# EasyEDA schematic JLCPCB_MEG_SCHEM.json

## Sheets
1 Sheet_1: TITLE: Sheet_1; REV: 1.0; Date: 2023-10-23; Sheet: 1/1; Drawn By: jbgs_ch_mex; Company: Your Company
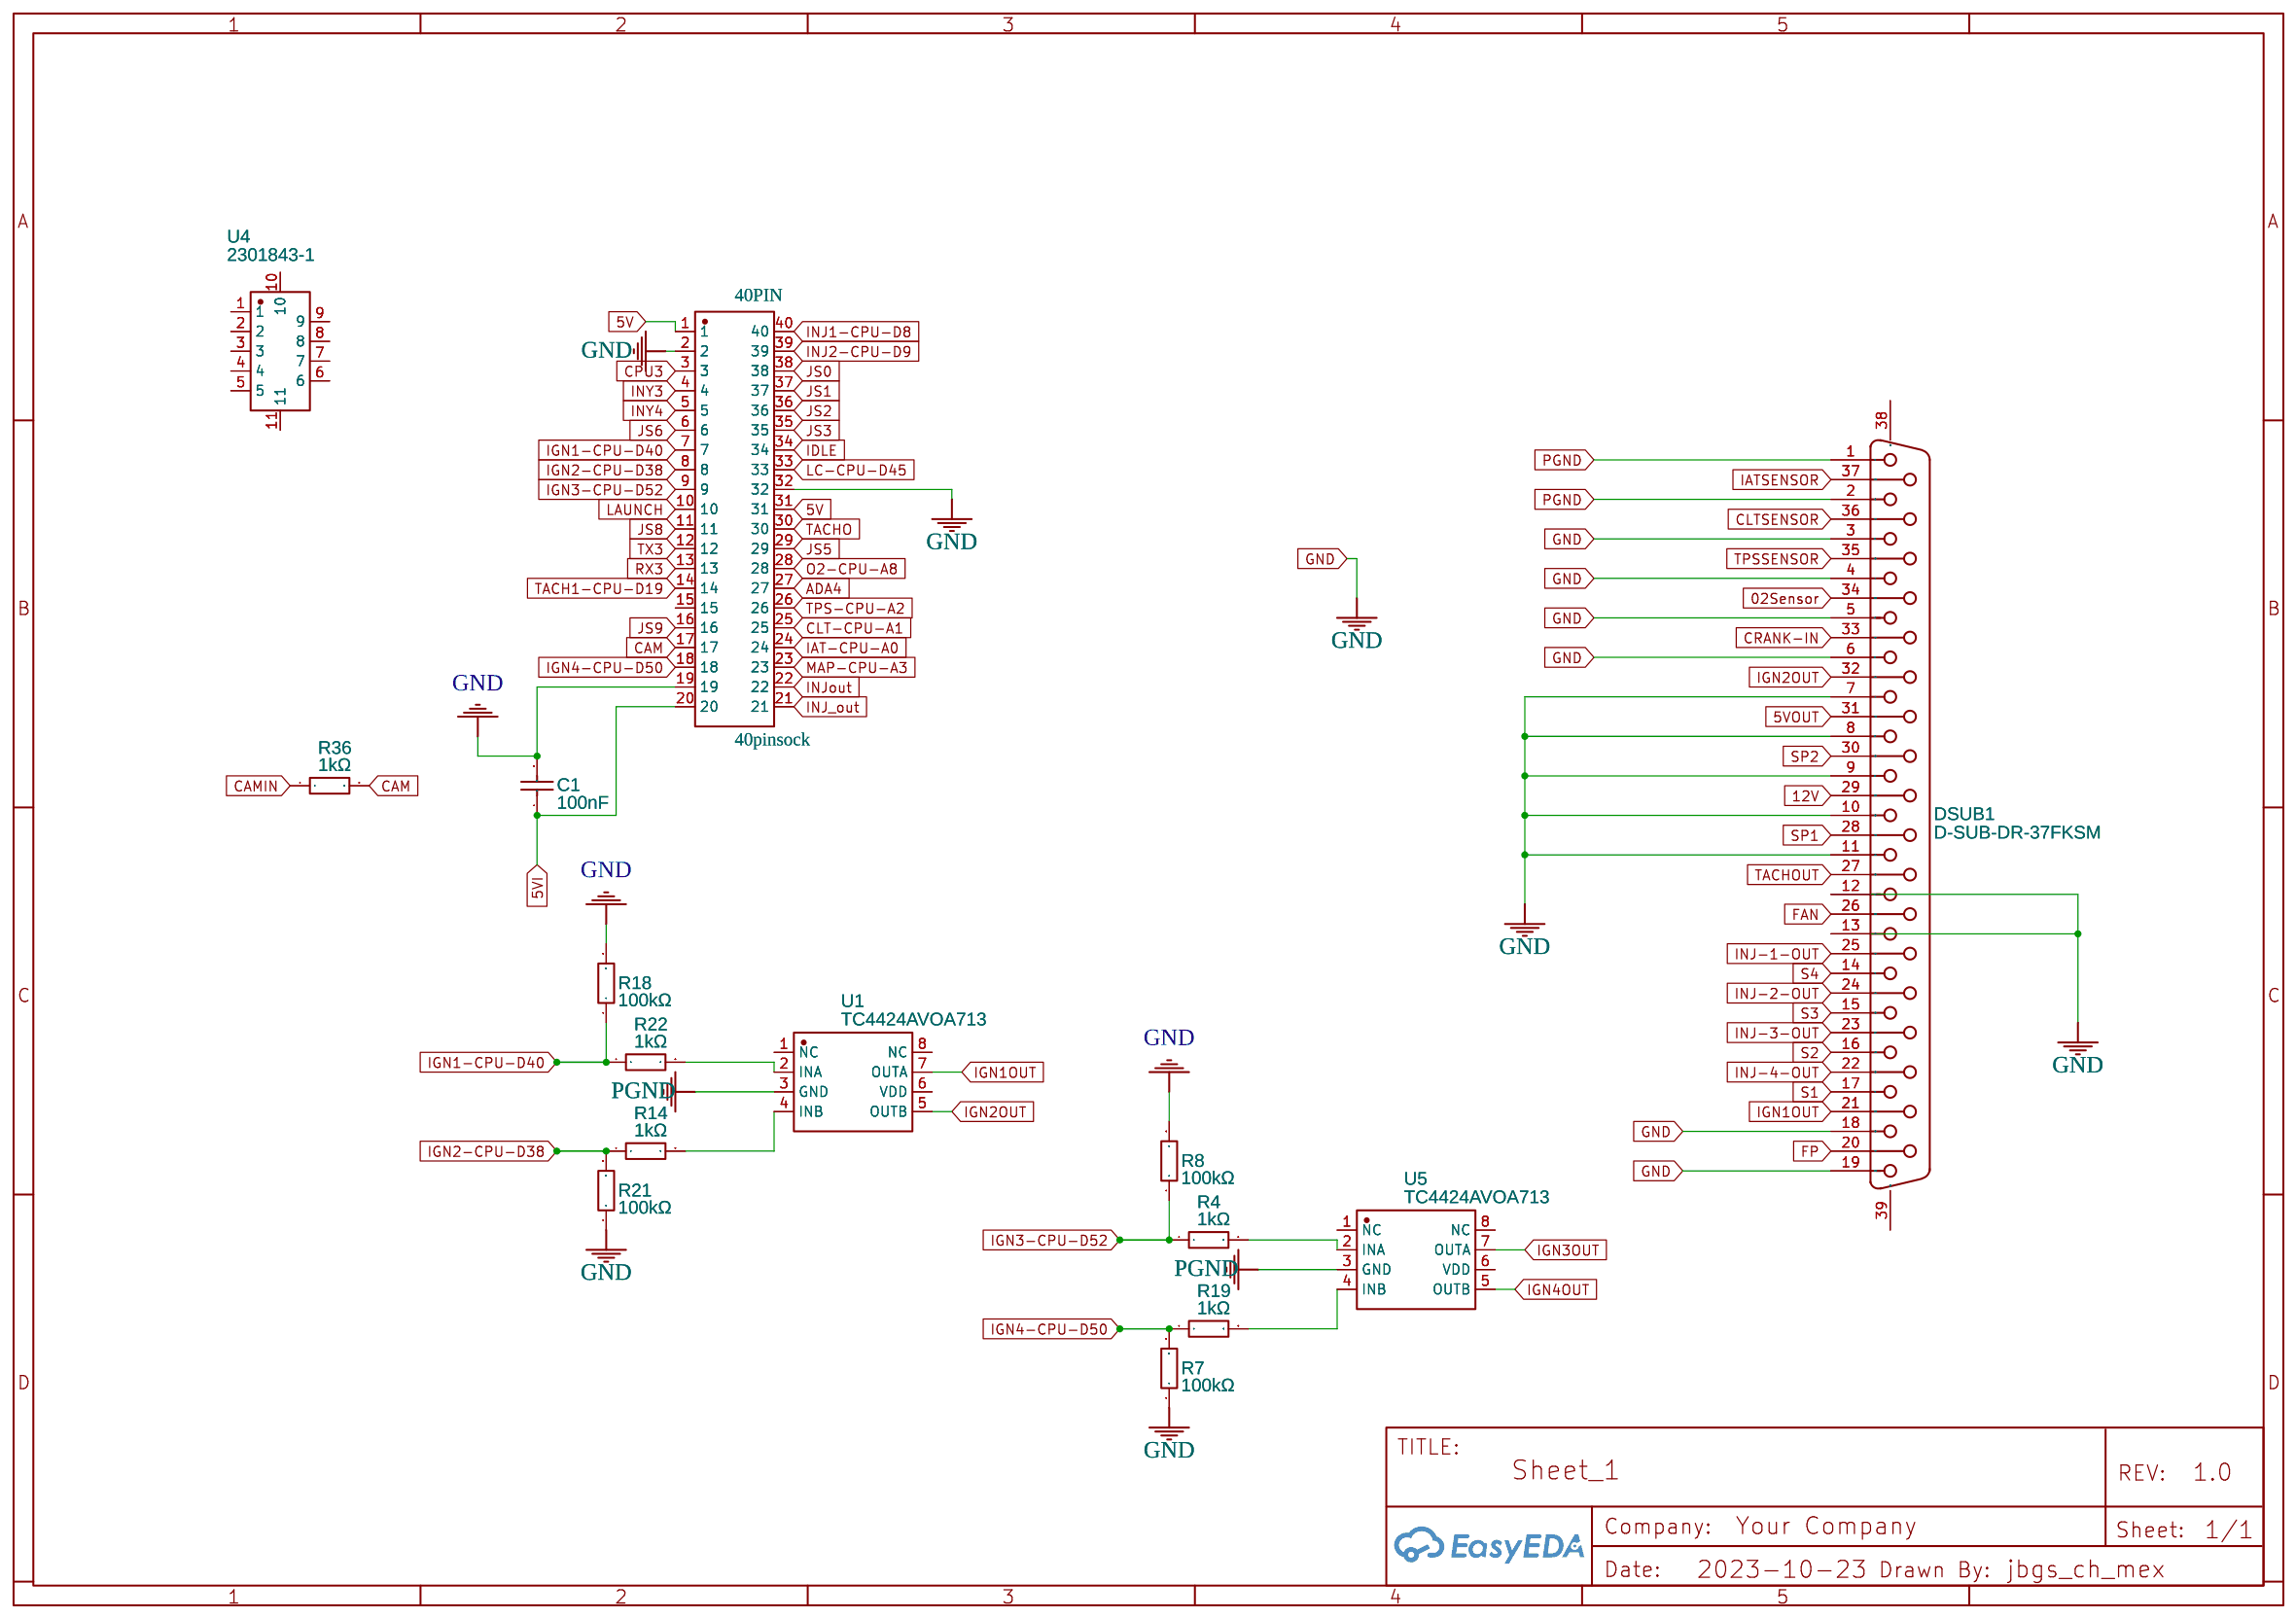
[diagram p0: Sheet_1]
2 Sheet_3: TITLE: Sheet_3
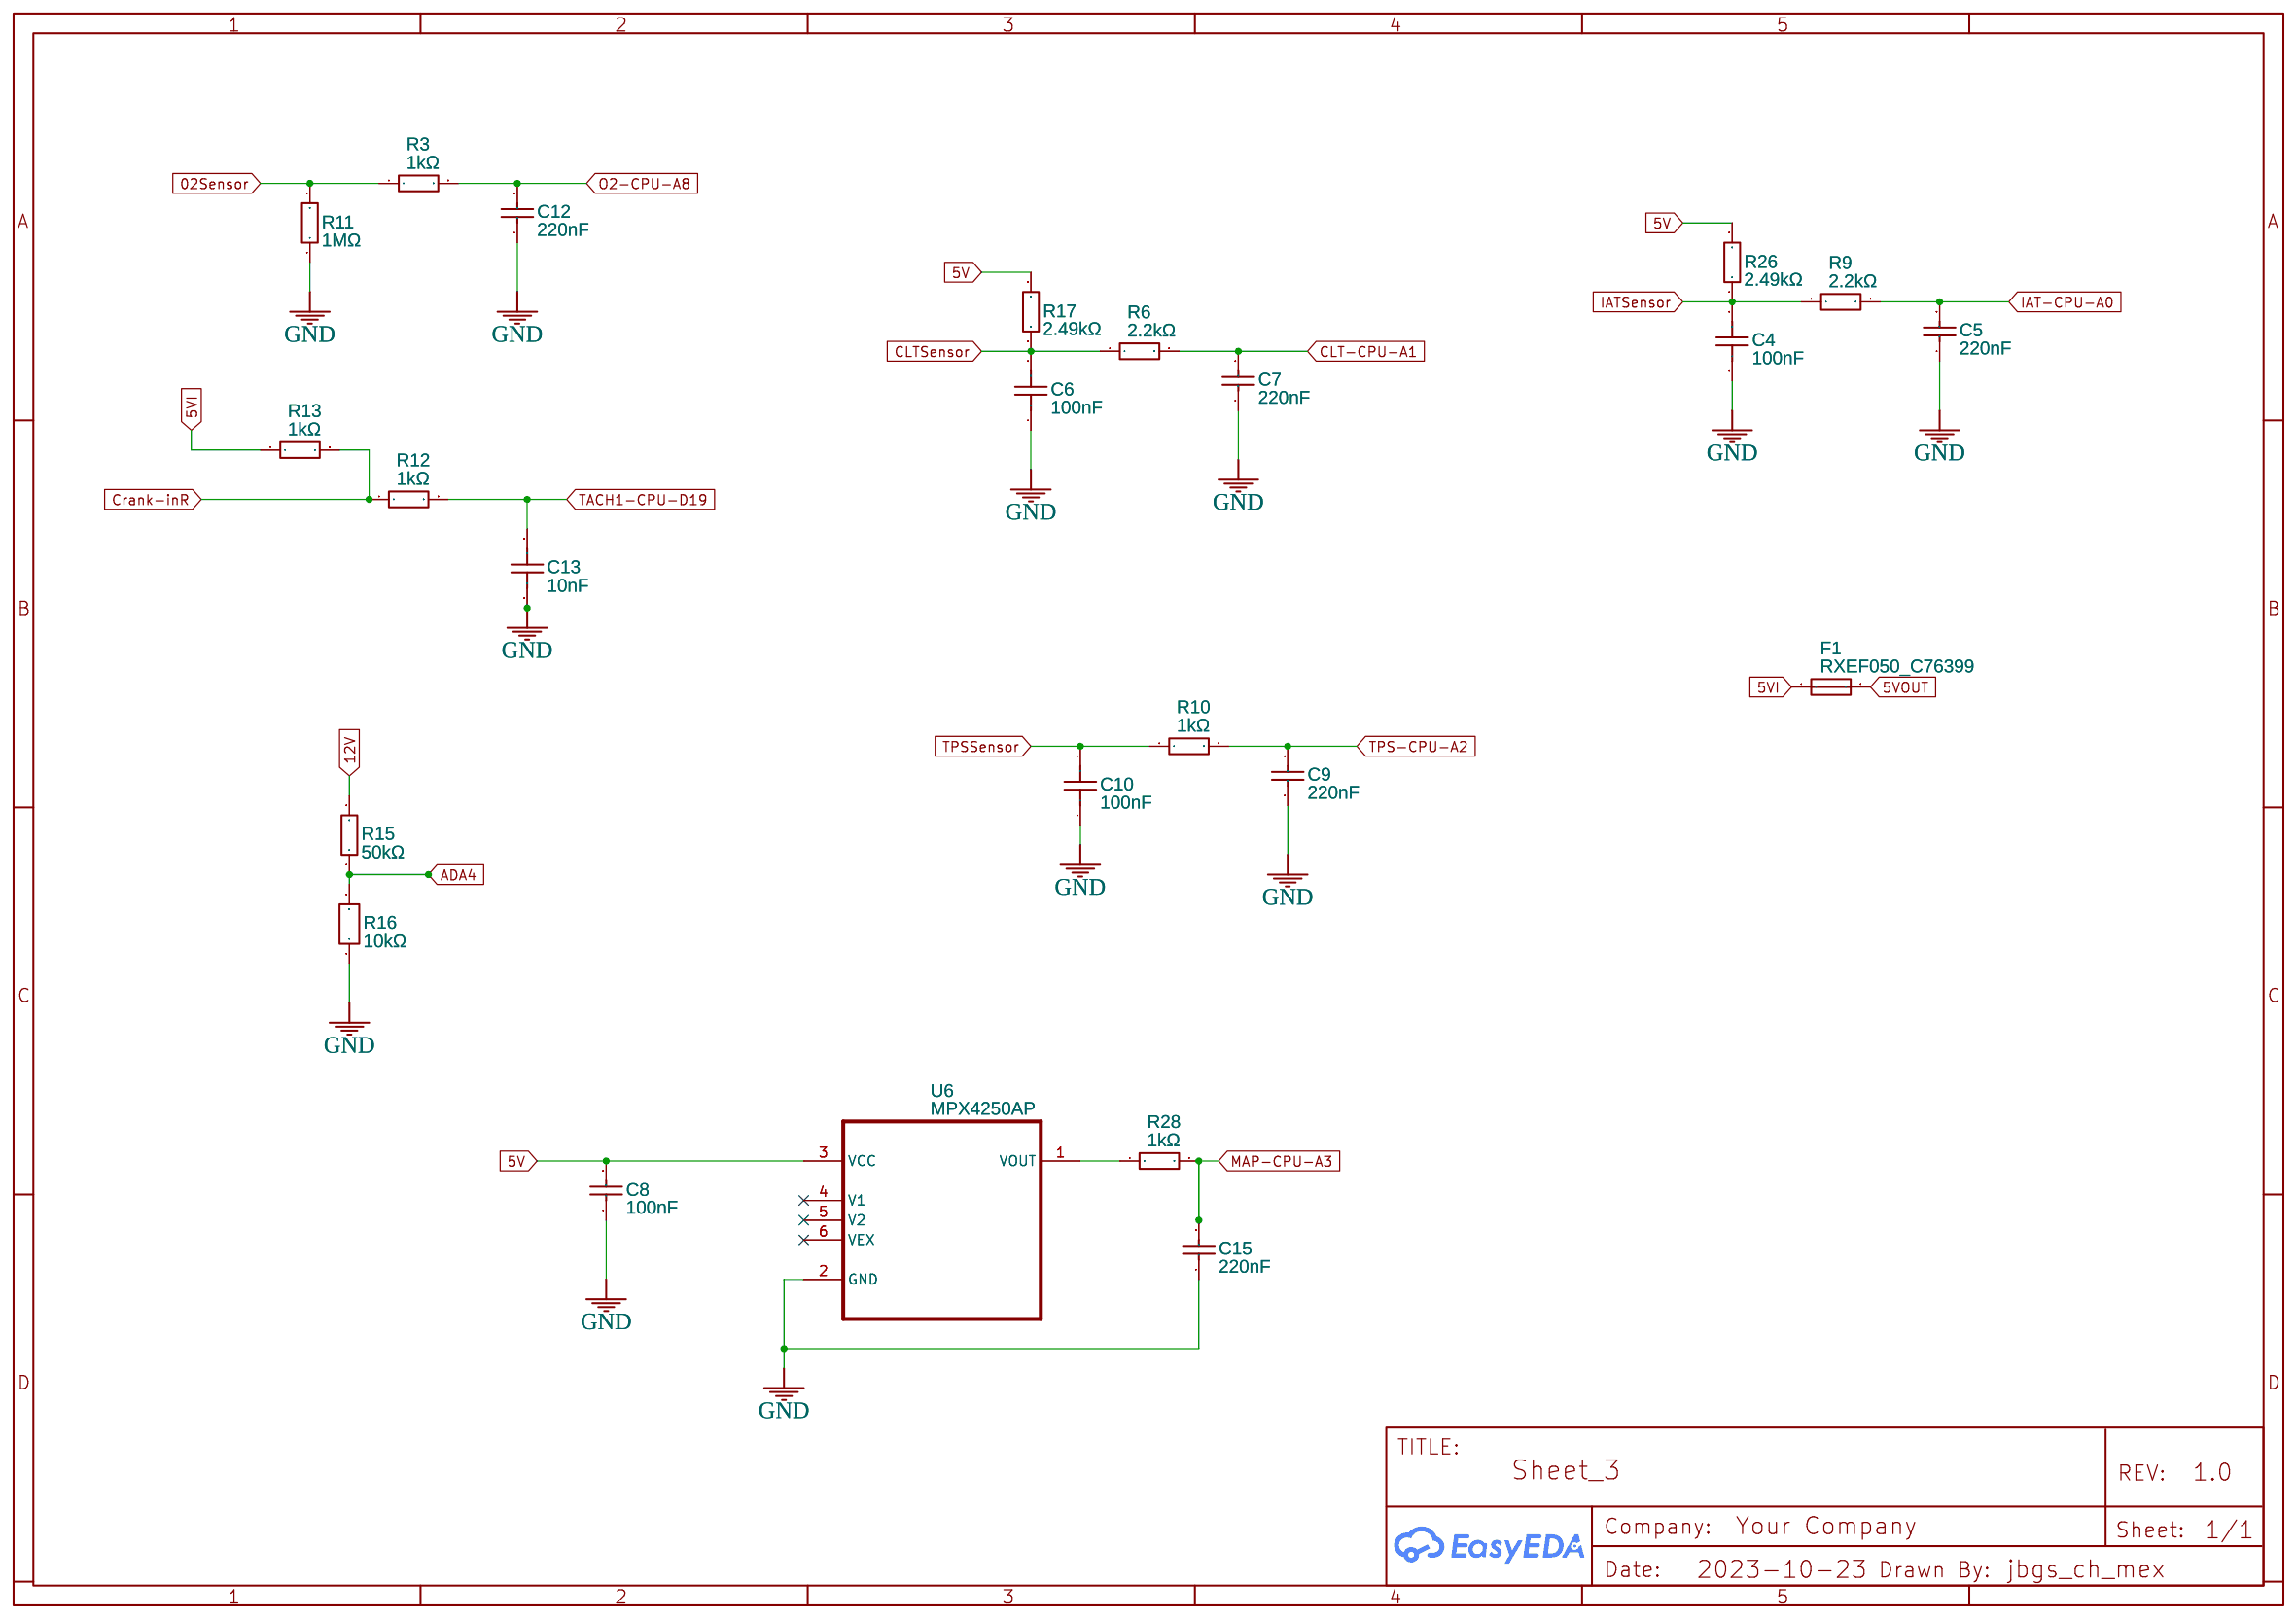
[diagram p1: Sheet_3]
3 Sheet_2: TITLE: Sheet_2
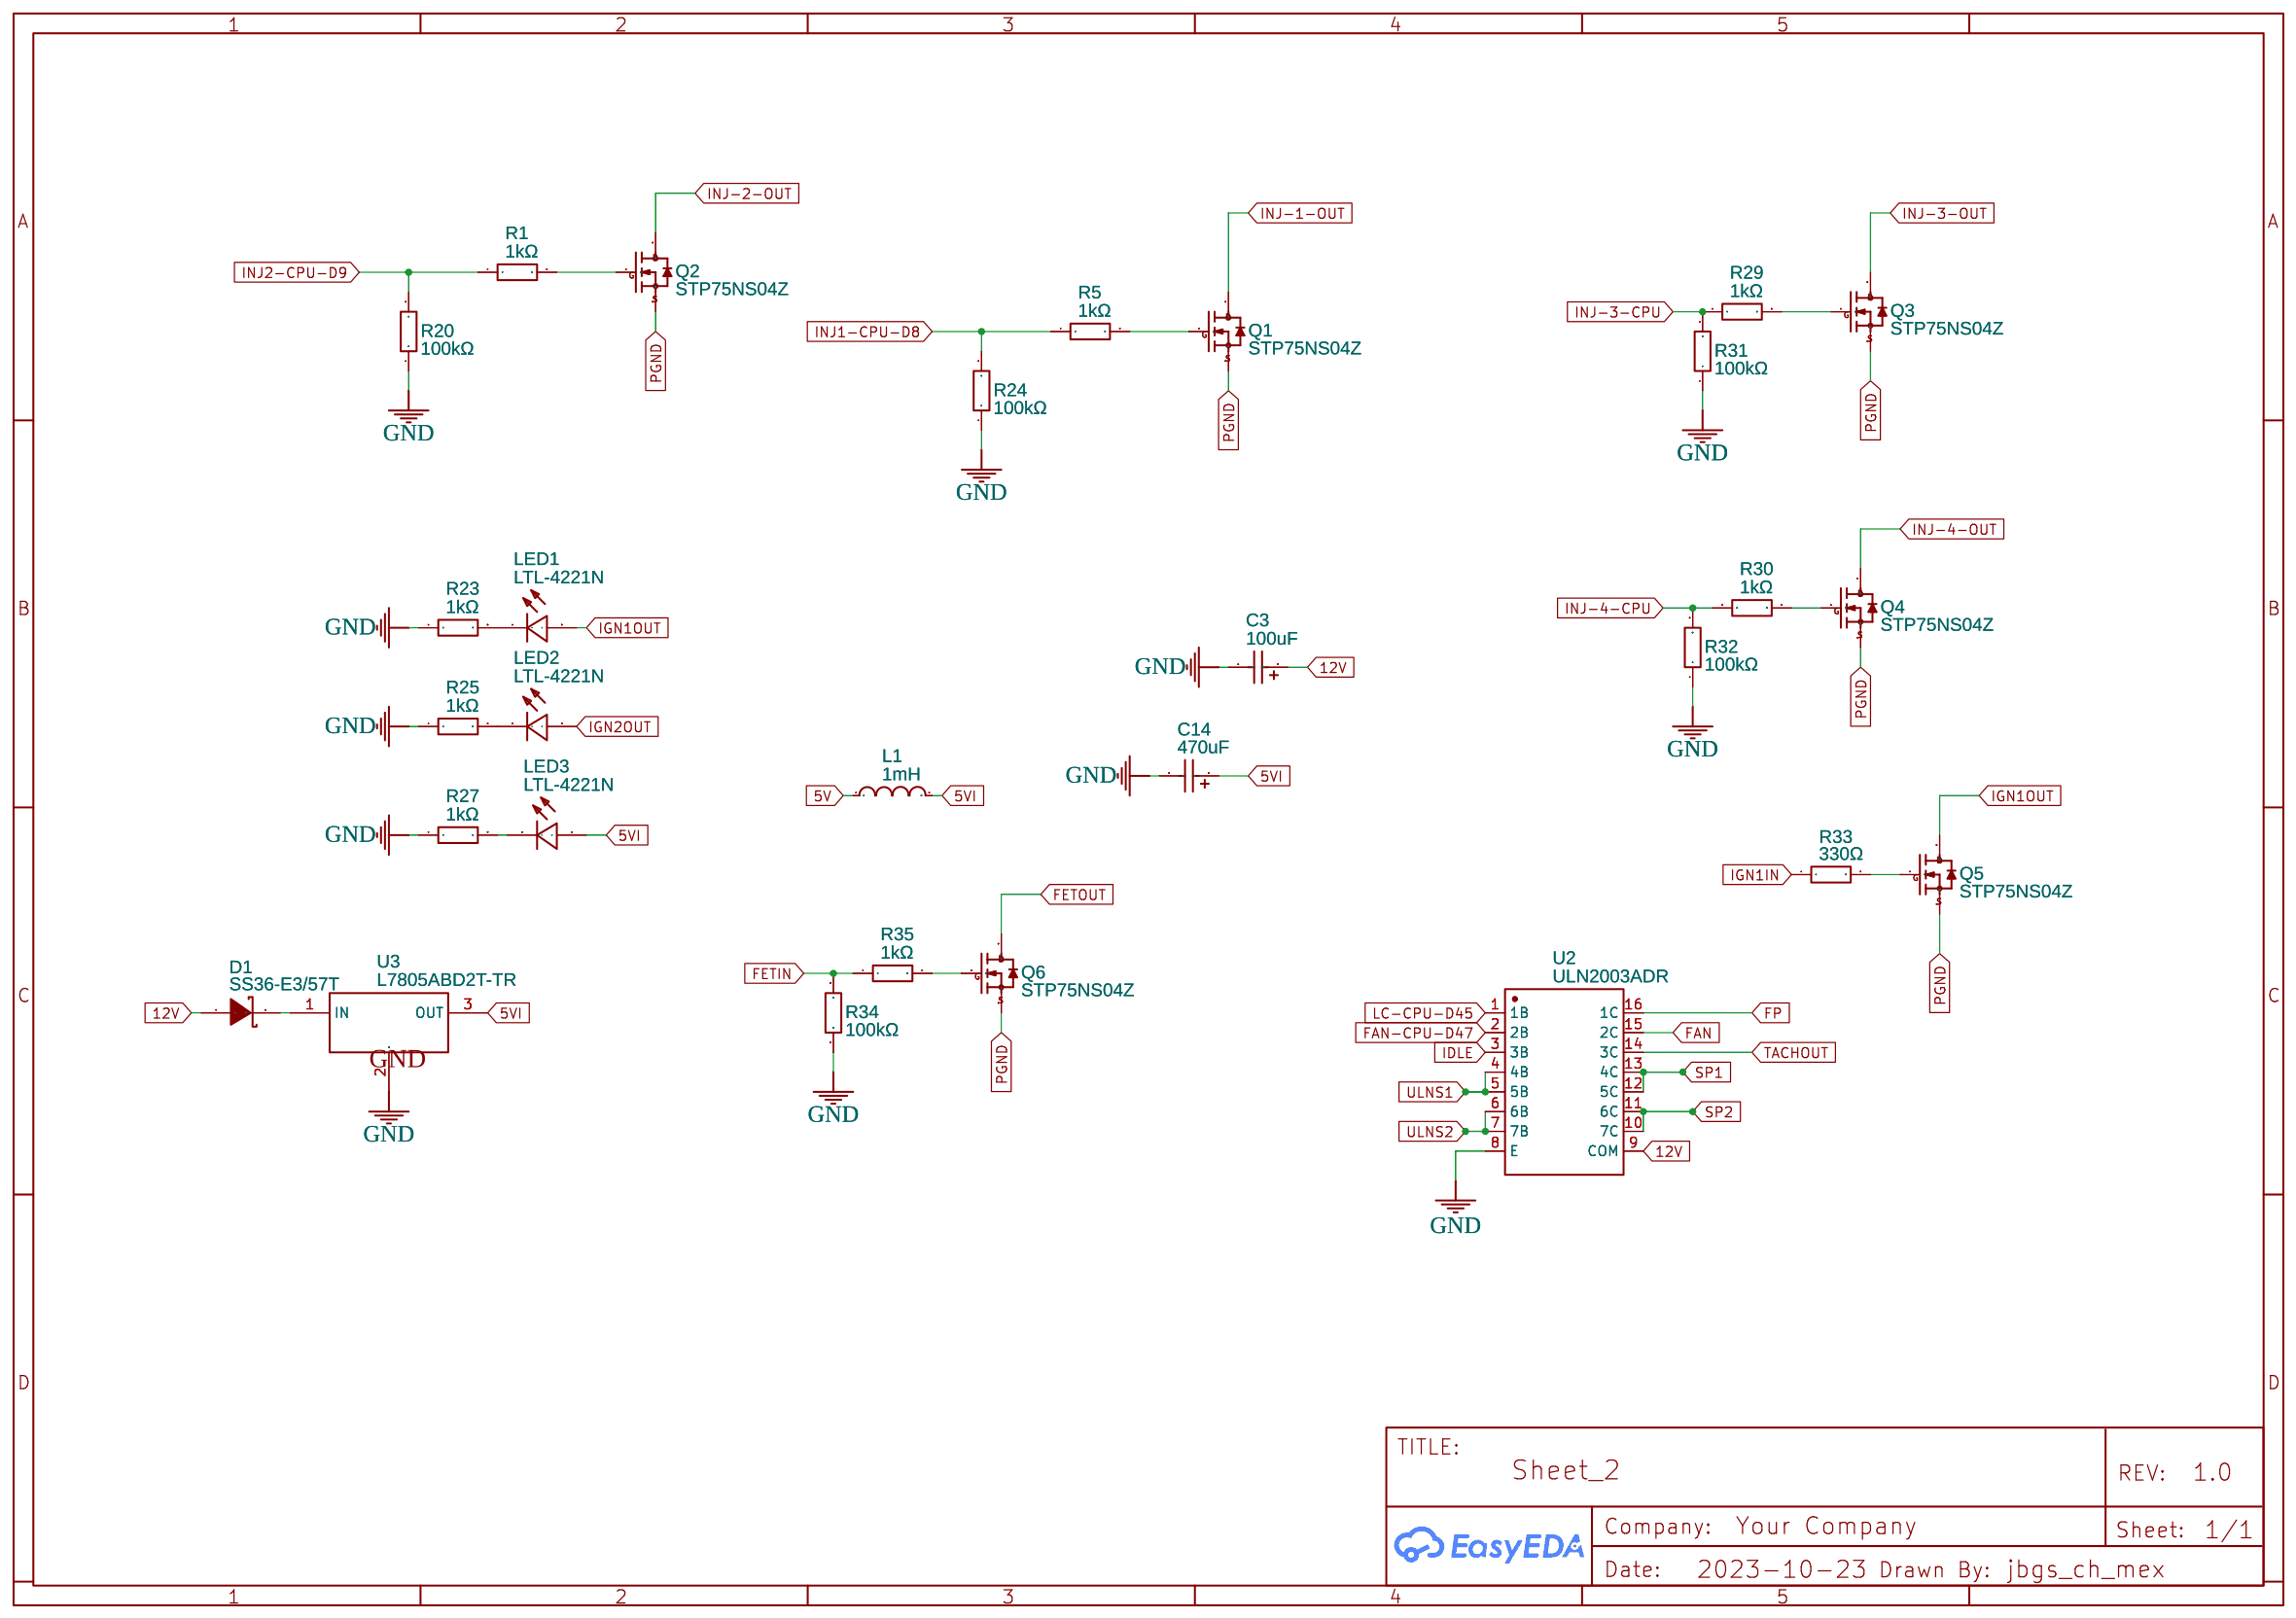
[diagram p2: Sheet_2]

## Parts
sheet Sheet_1
40PIN  40pinsock  [DIP-40_L52.3-W13.9-P2.54-LS15.2-BL-BASE]
C1  100nF  [C0805]
DSUB1  D-SUB-DR-37FKSM  [DB37-TH_ZHOURI_D-SUB-DR-37FKSM]
R4  1kΩ  [R0603]
R7  100kΩ  [R0603]
R8  100kΩ  [R0603]
R14  1kΩ  [R0603]
R18  100kΩ  [R0603]
R19  1kΩ  [R0603]
R21  100kΩ  [R0603]
R22  1kΩ  [R0603]
R36  1kΩ  [R0603]
U1  TC4424AVOA713  [SOIC-8_L4.9-W3.9-P1.27-LS6.0-BL]
U4  2301843-1  [DB9-TH_DB9FEMALE_C9900003585]
U5  TC4424AVOA713  [SOIC-8_L4.9-W3.9-P1.27-LS6.0-BL]
sheet Sheet_2
C3  100uF  [CAP-SMD_L7.3-W4.3-R-RD]
C14  470uF  [CASE-D_7343]
D1  SS36-E3/57T  [SMC_L7.1-W6.2-LS8.1-R-RD]
L1  1mH  [IND-SMD_L12.5-W12.5_SCDS125]
LED1  LTL-4221N  [LED-TH_BD3.0-P2.54-RD-RED]
LED2  LTL-4221N  [LED-TH_BD3.0-P2.54-RD-RED]
LED3  LTL-4221N  [LED-TH_BD3.0-P2.54-RD-RED]
Q1  STP75NS04Z  [TO-220(TO-220-3)]
Q2  STP75NS04Z  [TO-220(TO-220-3)]
Q3  STP75NS04Z  [TO-220(TO-220-3)]
Q4  STP75NS04Z  [TO-220(TO-220-3)]
Q5  STP75NS04Z  [TO-220(TO-220-3)]
Q6  STP75NS04Z  [TO-220(TO-220-3)]
R1  1kΩ  [R0805]
R5  1kΩ  [R0805]
R20  100kΩ  [R0805]
R23  1kΩ  [R0805]
R24  100kΩ  [R0805]
R25  1kΩ  [R0805]
R27  1kΩ  [R0805]
R29  1kΩ  [R0805]
R30  1kΩ  [R0805]
R31  100kΩ  [R0805]
R32  100kΩ  [R0805]
R33  330Ω  [R0805]
R34  100kΩ  [R0805]
R35  1kΩ  [R0805]
U2  ULN2003ADR  [SOIC-16_L9.9-W3.9-P1.27-LS6.0-BL]
U3  L7805ABD2T-TR  [TO-263-2_L10.0-W9.2-P5.08-LS15.3-TL-CW]
sheet Sheet_3
C4  100nF  [C0603]
C5  220nF  [C0603]
C6  100nF  [C0603]
C7  220nF  [C0603]
C8  100nF  [C0805]
C9  220nF  [C0603]
C10  100nF  [C0603]
C12  220nF  [C0603]
C13  10nF  [C0805]
C15  220nF  [C0603]
F1  RXEF050_C76399  [F1206]
R3  1kΩ  [R0805]
R6  2.2kΩ  [R0805]
R9  2.2kΩ  [R0805]
R10  1kΩ  [R0805]
R11  1MΩ  [R0805]
R12  1kΩ  [R0805]
R13  1kΩ  [R0805]
R15  50kΩ  [R0603]
R16  10kΩ  [R0603]
R17  2.49kΩ  [R0805]
R26  2.49kΩ  [R0805]
R28  1kΩ  [R0805]
U6  MPX4250AP  [MPX4250AP_TOP]

## Library data of the parts
C1 C8 = CC0805KRX7R9BB104: Supplier: LCSC; Manufacturer: YAGEO(国巨); Supplier Part: C49678; JLCPCB Part Class: Basic Part
DSUB1 = D-SUB-DR-37FKSM: Contributor: lcsc; Supplier: LCSC; Supplier Part: C5156644; Manufacturer: ZHOURI(洲日); JLCPCB Part Class: Extended Part; link: https://lcsc.com/eda_search?q=C5156644&%26type=1&ref=editor
R4 R14 R19 R22 R36 = 0603WAF1001T5E: Supplier: LCSC; Manufacturer: UNI-ROYAL(厚声); Supplier Part: C21190; JLCPCB Part Class: Basic Part
R7 R8 R18 R21 = 0603WAF1003T5E: Supplier: LCSC; Manufacturer: UNI-ROYAL(厚声); Supplier Part: C25803; JLCPCB Part Class: Basic Part
U1 U5 = TC4424AVOA713: Supplier: LCSC; Manufacturer: MICROCHIP(美国微芯); Supplier Part: C44150; JLCPCB Part Class: Extended Part
U4 = 2301843-1: Contributor: lcsc; Supplier: LCSC; Supplier Part: C3118153; Manufacturer: TE Connectivity(美国泰科); JLCPCB Part Class: Extended Part
C3 = TAJD107M020RNJ: Supplier: LCSC; Manufacturer: Kyocera AVX; Supplier Part: C99373; JLCPCB Part Class: Extended Part
C14 = T491D477K006AT: Supplier: LCSC; Manufacturer: KEMET(基美); Supplier Part: C116576; JLCPCB Part Class: Extended Part
D1 = SS36-E3/57T: Supplier: LCSC; Manufacturer: VISHAY(威世); Supplier Part: C35722; JLCPCB Part Class: Extended Part
L1 = SCDS127T-102M-N: Contributor: LCSC; Supplier: LCSC; Supplier Part: C329612; Manufacturer: chilisin(奇力新); JLCPCB Part Class: Extended Part
LED1-LED3 = LTL-4221N: Contributor: LCSC; Supplier: LCSC; Supplier Part: C125081; Manufacturer: LITEON(光宝); JLCPCB Part Class: Extended Part
Q1-Q6 = -: Supplier: Mouser; Manufacturer: STMicroelectronics; Contributor: LCSC; Supplier Part: 511-STP75NS04Z
R1 R3 R5 R10 R12 R13 R23 R25 R27-R30 R35 = 0805W8F1001T5E: Supplier: LCSC; Manufacturer: UNI-ROYAL(厚声); Supplier Part: C17513; JLCPCB Part Class: Basic Part; link: https://lcsc.com/eda_search?q=C17513&%26type=1&ref=editor
R20 R24 R31 R32 R34 = 0805W8F1003T5E_C149504: Contributor: LCSC; Supplier: LCSC; Supplier Part: C149504; Manufacturer: UNI-ROYAL(厚声); Manufacturer Part: 0805W8F1003T5E; JLCPCB Part Class: Basic Part; link: https://lcsc.com/eda_search?q=C149504&%26type=1&ref=editor
R33 = 0805W8F3300T5E: Supplier: LCSC; Manufacturer: UNI-ROYAL(厚声); Supplier Part: C17630; JLCPCB Part Class: Basic Part
U2 = ULN2003ADR: Supplier: LCSC; Manufacturer: TI(德州仪器); Supplier Part: C7512; JLCPCB Part Class: Basic Part
U3 = L7805ABD2T-TR: Supplier: LCSC; Manufacturer: ST(意法半导体); Supplier Part: C86206; JLCPCB Part Class: Extended Part
C4 C6 C10 = CC0603KRX7R9BB104: Supplier: LCSC; Manufacturer: YAGEO(国巨); Supplier Part: C14663; JLCPCB Part Class: Basic Part
C5 C7 C9 C12 C15 = CL10B224KA8NNNC: Supplier: LCSC; Manufacturer: SAMSUNG(三星); Supplier Part: C21120; JLCPCB Part Class: Basic Part
C13 = C0805C103K1RAC7800: Contributor: LCSC; Supplier: LCSC; Supplier Part: C141122; Manufacturer: KEMET; JLCPCB Part Class: Extended Part; link: https://lcsc.com/eda_search?q=C141122&%26type=1&ref=editor
F1 = RXEF050_C76399: Supplier: LCSC; Supplier Part: C553935; Manufacturer: Littelfuse(美国力特); Manufacturer Part: RXEF050; Contributor: LCSC; JLCPCB Part Class: Extended Part
R6 R9 = 0805W8F2201T5E: Supplier: LCSC; Manufacturer: UNI-ROYAL(厚声); Supplier Part: C17520; JLCPCB Part Class: Basic Part
R11 = 0805W8F1004T5E: Supplier: LCSC; Manufacturer: UNI-ROYAL(厚声); Supplier Part: C17514; JLCPCB Part Class: Basic Part
R15 = AR03BTC5002A: Contributor: LCSC; Supplier: LCSC; Supplier Part: C304067; Manufacturer: Viking(光颉); JLCPCB Part Class: Extended Part
R16 = SCR0603J10K: Supplier: LCSC; Supplier Part: C3017715; Manufacturer: VO(翔胜); JLCPCB Part Class: Extended Part; Contributor: lcsc
R17 R26 = 0805W8F2491T5E: Supplier: LCSC; Manufacturer: UNI-ROYAL(厚声); Supplier Part: C21237; JLCPCB Part Class: Extended Part
U6 = -: IC, SENSOR, ABS PRESS 36.3 PSI,CASE 867B-04; Manufacturer Part: ?

## Nets
5V: 40PIN.1 40PIN.31 C8.2 L1.1 R17.2 R26.2 U6.3(VCC)
5VI: 40PIN.20 C1.1 C14.1 F1.1 L1.2 LED3.2(+) R13.1 U3.3(OUT)
5VOUT: DSUB1.31(26) F1.2
12V: C3.1 D1.1(A) DSUB1.29(28) R15.2 U2.9(COM)
GND: 40PIN.2 40PIN.19 40PIN.32 C1.2 C3.2 C4.1 C5.1 C6.1 C7.1 C8.1 C9.1 C10.1 C12.1 C13.1 C14.2 C15.1 DSUB1.3 DSUB1.4 DSUB1.5 DSUB1.6 DSUB1.7 DSUB1.8 DSUB1.9 DSUB1.10 DSUB1.11 DSUB1.12 DSUB1.13 DSUB1.18 DSUB1.19 R7.1 R8.2 R11.1 R16.1 R18.2 R20.1 R21.1 R23.1 R24.1 R25.1 R27.1 R31.1 R32.1 R34.1 U2.8(E) U3.2(GND) U6.2(GND)
PGND: DSUB1.1 DSUB1.2 Q1.3(S) Q2.3(S) Q3.3(S) Q4.3(S) Q5.3(S) Q6.3(S) U1.3(GND) U5.3(GND)
02Sensor: DSUB1.34(23) R3.1 R11.2
ADA4: 40PIN.27 R15.1 R16.2
CAM: 40PIN.17 R36.2
CAMIN: R36.1
CLT-CPU-A1: 40PIN.25 C7.2 R6.2
CLTSENSOR: DSUB1.36(21)
CLTSensor: C6.2 R6.1 R17.1
CPU3: 40PIN.3
CRANK-IN: DSUB1.33(24)
Crank-inR: R12.1 R13.2
FAN: DSUB1.26(31) U2.15(2C)
FAN-CPU-D47: U2.2(2B)
FETIN: R34.2 R35.1
FETOUT: Q6.2(D)
FP: DSUB1.20(37) U2.16(1C)
IAT-CPU-A0: 40PIN.24 C5.2 R9.2
IATSENSOR: DSUB1.37(20)
IATSensor: C4.2 R9.1 R26.1
IDLE: 40PIN.34 U2.3(3B)
IGN1-CPU-D40: 40PIN.7 R18.1 R22.1
IGN1IN: R33.1
IGN1OUT: DSUB1.21(36) LED1.2(+) Q5.2(D) U1.7(OUTA)
IGN2-CPU-D38: 40PIN.8 R14.1 R21.2
IGN2OUT: DSUB1.32(25) LED2.2(+) U1.5(OUTB)
IGN3-CPU-D52: 40PIN.9 R4.1 R8.1
IGN3OUT: U5.7(OUTA)
IGN4-CPU-D50: 40PIN.18 R7.2 R19.1
IGN4OUT: U5.5(OUTB)
INJ1-CPU-D8: 40PIN.40 R5.1 R24.2
INJ2-CPU-D9: 40PIN.39 R1.1 R20.2
INJ-1-OUT: DSUB1.25(32) Q1.2(D)
INJ-2-OUT: DSUB1.24(33) Q2.2(D)
INJ-3-CPU: R29.1 R31.2
INJ-3-OUT: DSUB1.23(34) Q3.2(D)
INJ-4-CPU: R30.1 R32.2
INJ-4-OUT: DSUB1.22(35) Q4.2(D)
INJ_out: 40PIN.21
INJout: 40PIN.22
INY3: 40PIN.4
INY4: 40PIN.5
JS0: 40PIN.38
JS1: 40PIN.37
JS2: 40PIN.36
JS3: 40PIN.35
JS5: 40PIN.29
JS6: 40PIN.6
JS8: 40PIN.11
JS9: 40PIN.16
LAUNCH: 40PIN.10
LC-CPU-D45: 40PIN.33 U2.1(1B)
MAP-CPU-A3: 40PIN.23 C15.2 R28.2
O2-CPU-A8: 40PIN.28 C12.2 R3.2
RX3: 40PIN.13
S1: DSUB1.17
S2: DSUB1.16
S3: DSUB1.15
S4: DSUB1.14
SP1: DSUB1.28(29) U2.12(5C) U2.13(4C)
SP2: DSUB1.30(27) U2.10(7C) U2.11(6C)
TACH1-CPU-D19: 40PIN.14 C13.2 R12.2
TACHO: 40PIN.30
TACHOUT: DSUB1.27(30) U2.14(3C)
TPS-CPU-A2: 40PIN.26 C9.2 R10.2
TPSSENSOR: DSUB1.35(22)
TPSSensor: C10.2 R10.1
TX3: 40PIN.12
ULNS1: U2.4(4B) U2.5(5B)
ULNS2: U2.6(6B) U2.7(7B)
Net-(D1-2): D1.2(K) U3.1(IN)
Net-(LED1-1): LED1.1(-) R23.2
Net-(LED2-1): LED2.1(-) R25.2
Net-(LED3-1): LED3.1(-) R27.2
Net-(Q1-1): Q1.1(G) R5.2
Net-(Q2-1): Q2.1(G) R1.2
Net-(Q3-1): Q3.1(G) R29.2
Net-(Q4-1): Q4.1(G) R30.2
Net-(Q5-1): Q5.1(G) R33.2
Net-(Q6-1): Q6.1(G) R35.2
Net-(R4-2): R4.2 U5.2(INA)
Net-(R14-2): R14.2 U1.4(INB)
Net-(R19-2): R19.2 U5.4(INB)
Net-(R22-2): R22.2 U1.2(INA)
Net-(R28-1): R28.1 U6.1(VOUT)

Not connected (* = marked no-connect by the designer): 40PIN 15; DSUB1 38 39; U1 1(NC) 6(VDD) 8(NC); U4 1 2 3 4 5 6 7 8 9 10 11; U5 1(NC) 6(VDD) 8(NC); U6 4(V1)* 5(V2)* 6(VEX)*
